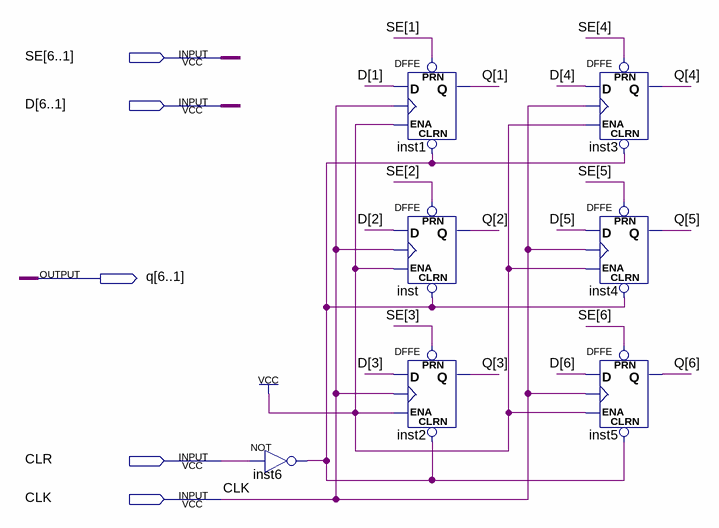
[diagram p0: schematic sheet]
// Quartus schematic se6_1.bdf as structural Verilog: 7 symbols, 5 pins
module se6_1 (
  input  [6:1] SE,
  input  [6:1] D,
  input  CLR,
  input  CLK,
  output [6:1] q
);

  wire inst6_out;

  not inst6 (inst6_out, CLR);
  DFFE inst1 (.PRN(SE[1]), .CLRN(inst6_out), .D(D[1]), .CLK(CLK), .ENA(1'b1), .Q(q[1]));
  DFFE inst (.PRN(SE[2]), .CLRN(inst6_out), .D(D[2]), .CLK(CLK), .ENA(1'b1), .Q(q[2]));
  DFFE inst2 (.PRN(SE[3]), .CLRN(inst6_out), .D(D[3]), .CLK(CLK), .ENA(1'b1), .Q(q[3]));
  DFFE inst3 (.PRN(SE[4]), .CLRN(inst6_out), .D(D[4]), .CLK(CLK), .ENA(1'b1), .Q(q[4]));
  DFFE inst4 (.PRN(SE[5]), .CLRN(inst6_out), .D(D[5]), .CLK(CLK), .ENA(1'b1), .Q(q[5]));
  DFFE inst5 (.PRN(SE[6]), .CLRN(inst6_out), .D(D[6]), .CLK(CLK), .ENA(1'b1), .Q(q[6]));
endmodule
